# Altium schematic sheet ESP32-S3.SchDoc
size A; SheetNumber: 1; SheetTotal: 2
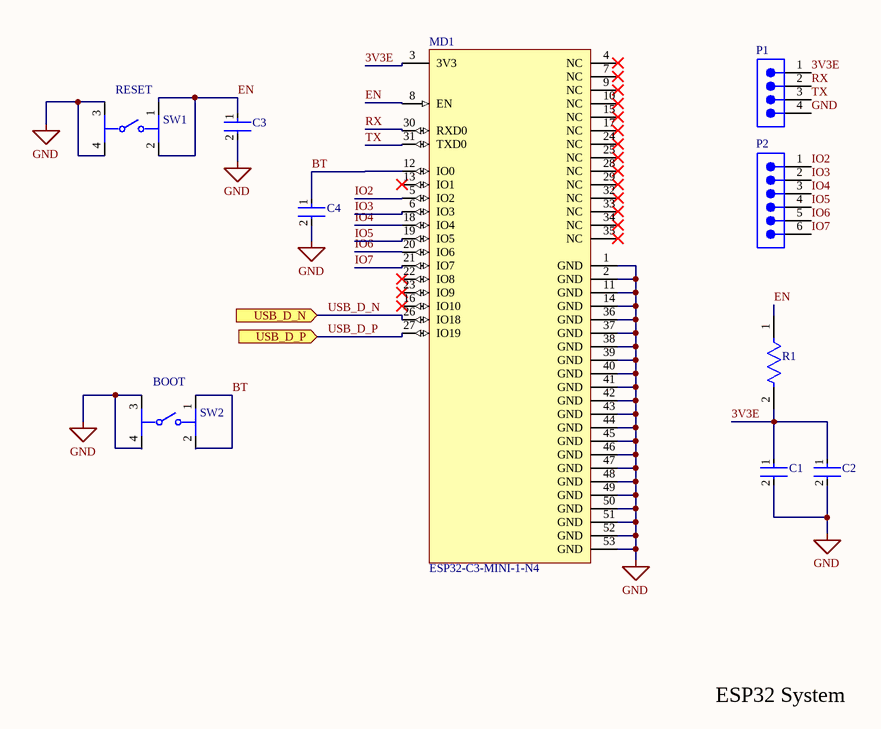
[diagram p0: ESP32-S3.SchDoc]

## Parts
C1  HMK105B7103MVHFE  [FP-0402-L_1_0_0_05-W_0_5-IPC_A]  (value not drawn)
C2  LMK316AB7106ML-T  [FP-1206-L_3_2_0_2-W_1_6_0-IPC_A]  (value not drawn)
C3  HMK105B7103MVHFE  [FP-0402-L_1_0_0_05-W_0_5-IPC_A]  (value not drawn)
C4  HMK105B7103MVHFE  [FP-0402-L_1_0_0_05-W_0_5-IPC_A]  (value not drawn)
MD1  ESP32-C3-MINI-1-N4  [FP-ESP32-C3-MINI-1-N4-MFG]
P1  TSW-104-08-G-S  [SMTC-TSW-104-08-X-S]  (value not drawn)
P2  TSW-106-23-G-S  [SMTC-TSW-106-23-X-S]  (value not drawn)
R1  CR2010-JW-103ELF  [FP-CR2010-IPC_C]  (value not drawn)
SW1  RESET  [FP-PTS647SM38SMTR2LFS-MFG]
SW2  BOOT  [FP-PTS647SM38SMTR2LFS-MFG]

## Ports
USB_D_N (in, see REG[1B]), USB_D_P (in, see REG[1B])

## Nets
GND: C1.2 C2.2 C3.2 C4.2 MD1.1(GND) MD1.2(GND) MD1.11(GND) MD1.14(GND) MD1.36(GND) MD1.37(GND) MD1.38(GND) MD1.39(GND) MD1.40(GND) MD1.41(GND) MD1.42(GND) MD1.43(GND) MD1.44(GND) MD1.45(GND) MD1.46(GND) MD1.47(GND) MD1.48(GND) MD1.49(GND) MD1.50(GND) MD1.51(GND) MD1.52(GND) MD1.53(GND) P1.4 SW1.3 SW1.4 SW2.3 SW2.4
3V3E: C1.1 C2.1 MD1.3(3V3) P1.1 R1.2
BT: C4.1 MD1.12(IO0) SW2.1 SW2.2
EN: C3.1 MD1.8(EN) R1.1 SW1.1 SW1.2
IO2: MD1.5(IO2) P2.1
IO3: MD1.6(IO3) P2.2
IO4: MD1.18(IO4) P2.3
IO5: MD1.19(IO5) P2.4
IO6: MD1.20(IO6) P2.5
IO7: MD1.21(IO7) P2.6
RX: MD1.30(RXD0) P1.2
TX: MD1.31(TXD0) P1.3
USB_D_N: MD1.26(IO18) ; port USB_D_N
USB_D_P: MD1.27(IO19) ; port USB_D_P

Not connected (* = marked no-connect by the designer): MD1 4(NC)* 7(NC)* 9(NC)* 10(NC)* 13(IO1)* 15(NC)* 16(IO10)* 17(NC)* 22(IO8)* 23(IO9)* 24(NC)* 25(NC)* 28(NC)* 29(NC)* 32(NC)* 33(NC)* 34(NC)* 35(NC)*

## Notes on the sheet
- ESP32 System

## Library data of the parts
C1 C3 C4 = CMP-14477-001757-2: None
C2 = CMP-14477-003406-2: None; Dielectric: X7R; Capacitance: 10uF; Voltage: 10V; Tolerance: 20%; Height: 1.6mm; Length: 0.126inch; Min Operating Temperature: -55°C; Mount: Surface Mount; Thickness: 0.071inch; Width: 0.063inch; Max Operating Temperature: 125°C; Depth: 1.6mm; RoHS Compliant: Yes; Voltage Rating: 10V; Packaging: Tape and Reel; Case/Package: 1206
MD1 = CMP-10700-116589975-1: Multiprotocol Modules SMD module, ESP32-C3FN4, PCB antenna, -40 C +85 C; Max Frequency: 2.484GHz; Min Supply Voltage: 3V; Current - Transmitting: 350mA; Interface: SPI; Data Rate: 150Mbps; Max Supply Voltage: 3.6V; Number of GPIO: 13; Current - Receiving: 84mA; Min Operating Temperature: -40°C; Height: 2.55mm; Ambient Temperature Range High: 85°C; Max Operating Temperature: 85°C
P1 = CMP-1024-00357-1: 0.025" SQ Post Header, Through-hole, Vertical, -55 to 125 degC, 2.54 mm Pitch, 4-Pin, Male, RoHS; Manufacturer: Samtec; Pitch: 2.54 mm; RoHS: True; ComponentLink3URL: http://www.samtec.com/documents/webfiles/cpdf/TSW-XXX-XX-XXX-X-XX-XXX-MKT.pdf; Mounting Technology: Through-hole; ComponentLink2URL: http://www.samtec.com/documents/webfiles/pdf/TSW_TH.PDF; ComponentLink1URL: http://www.samtec.com; ComponentLink3Description: Package Specification; PackageVersion: DM, 8/1988; ComponentLink2Description: Datasheet; PackageReference: TSW-104-08-X-S; PackageDescription: .025[0.64] SQ. Post Terminal Strip Assembly; PartNumber: TSW-104-08-G-S; ComponentLink1Description: Manufacturer URL; Temperature Range: -55 to 125 degC; DatasheetVersion: F-214; Orientation: Vertical
P2 = CMP-1024-00396-1: 0.025" SQ Post Header, Through-hole, Vertical, -55 to 125 degC, 2.54 mm Pitch, 6-Pin, Male, RoHS; Manufacturer: Samtec; Pitch: 2.54 mm; Orientation: Vertical; Mounting Technology: Through-hole; RoHS: True; PackageVersion: DM, 8/1988; ComponentLink3Description: Package Specification; PackageDescription: .025[0.64] SQ. Post Terminal Strip Assembly; ComponentLink2URL: http://www.samtec.com/documents/webfiles/pdf/TSW_TH.PDF; PartNumber: TSW-106-23-G-S; Temperature Range: -55 to 125 degC; PackageReference: TSW-106-23-X-S; ComponentLink1Description: Manufacturer URL; ComponentLink2Description: Datasheet; ComponentLink3URL: http://www.samtec.com/documents/webfiles/cpdf/TSW-XXX-XX-XXX-X-XX-XXX-MKT.pdf; DatasheetVersion: F-214; ComponentLink1URL: http://www.samtec.com
R1 = CMP-07231-003456-1: Thick Film Chip Resistors 2010 10kΩ 0.5W 5% 200ppm/°C; Resistance: 10kR; Voltage Rating: 200V; Power Rating: 500mW; Tolerance: 5%; Contact Plating: Tin; Length: 5mm; Case/Package: 2010; Package Quantity: 4000; Max Operating Temperature: 155°C; Case Code (Imperial): 2010; Mount: Surface Mount; Case Code (Metric): 5025; Width: 2.5mm; Temperature Coefficient: 200ppm/°C; Packaging: Tape and Reel; Height: 0.6mm; Radiation Hardening: No; Composition: Thick Film; Min Operating Temperature: -55°C; Termination: SMD/SMT
SW1 SW2 = CMP-10040-000031-1: TACT 4.5 X 4.5, 3.8 MM H, 1.8N,; Operating Force: 180gf; Throw Configuration: SPST; Mechanical Life: 100000Cycles; Ratings: IP40; Switch Travel: 0.25mm; Switch Function: Off-Mom; Actuator Type: Standard; Illumination Type: Non-Illuminated; Max Operating Temperature: 70°C; Packaging: Cut Tape; Min Operating Temperature: -20°C; Mount: Surface Mount; Termination: Gull Wing